# EAGLE design Keychain rev2 (EAGLE 9.5.2)
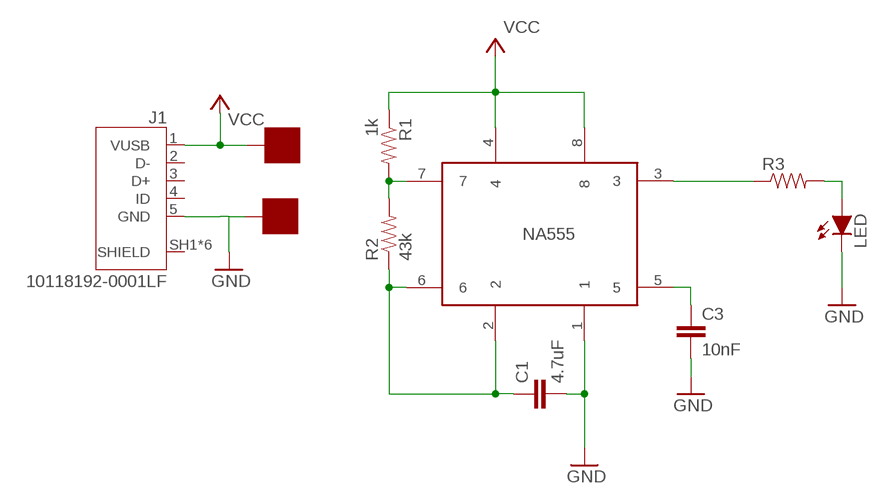
[diagram p0: schematic, sheet 1]

## Parts
5V  SOLDER_PAD  [SOLDER_PAD_XSMALL]
C1  4.7uF  CAP0603-CAP  [0603-CAP]
C3  10nF  CAP0603-CAP  [0603-CAP]
GND  SOLDER_PAD  [SOLDER_PAD_XSMALL]
J1  10118192-0001LF  [AMPHENOL_10118192-0001LF]
LED  LED-0603  [LED-603]
NA555  NA555SO-8  [SOIC-08]
R1  1k  RESISTOR0603-RES  [0603-RES]
R2  43k  RESISTOR0603-RES  [0603-RES]
R3  RESISTOR0603  [0603-RES]

## Nets
GND: C1.2 C3.2 GND.P$1 J1.5(GND) LED.C NA555.1
N$1: LED.A R3.2
N$2: C1.1 NA555.2 NA555.6 R2.1
N$9: NA555.7 R1.2 R2.2
N$13: C3.1 NA555.5
RED: NA555.3 R3.1
VCC: 5V.P$1 J1.1(VUSB) NA555.4 NA555.8 R1.1
Unconnected: J1.2(D-) J1.3(D+) J1.4(ID) J1.SH1(SHIELD) J1.SH2(SHIELD) J1.SH3(SHIELD) J1.SH4(SHIELD) J1.SH5(SHIELD) J1.SH6(SHIELD)

## Library data of the parts
5V GND = HyTechDevices:SOLDER_PAD: Solder pad used to attach wires directly to PCB
C1 C3 = HyTechDevices:CAP: Capacitor Standard 0603 ceramic capacitor, and 0.1" leaded capacitor.; TOLERANCE: 5%; VOLTAGE: 25V
J1 = HyTechDevices:10118192-0001LF: Single Port 5 Contact Horizontal Right Angle Shielded Micro B USB 2.0 Connector; AVAILABILITY: Unavailable; DESCRIPTION: USB - micro B USB 2.0 Receptacle Connector 5 Position Surface Mount, Right Angle; MF: Amphenol ICC; MP: 10118192-0001LF; PACKAGE: None; PRICE: None
LED = HyTechDevices:LED: Light Emitting Diode (LED) Source: Dangerous Prototypes Eagle Library <https://github.com/DangerousPrototypes/Eagle_Part_Library>
NA555 = HyTechDevices:NA555: Texas Instruments NA555 timer. Data sheet <http://www.ti.com/lit/ds/symlink/se555.pdf>
R1 R2 = HyTechDevices:RESISTOR: Resistor Basic schematic elements and footprints for 0603, 1206, and PTH resistors.; TOLERANCE: 1%
R3 = HyTechDevices:RESISTOR: Resistor Basic schematic elements and footprints for 0603, 1206, and PTH resistors.

## Board
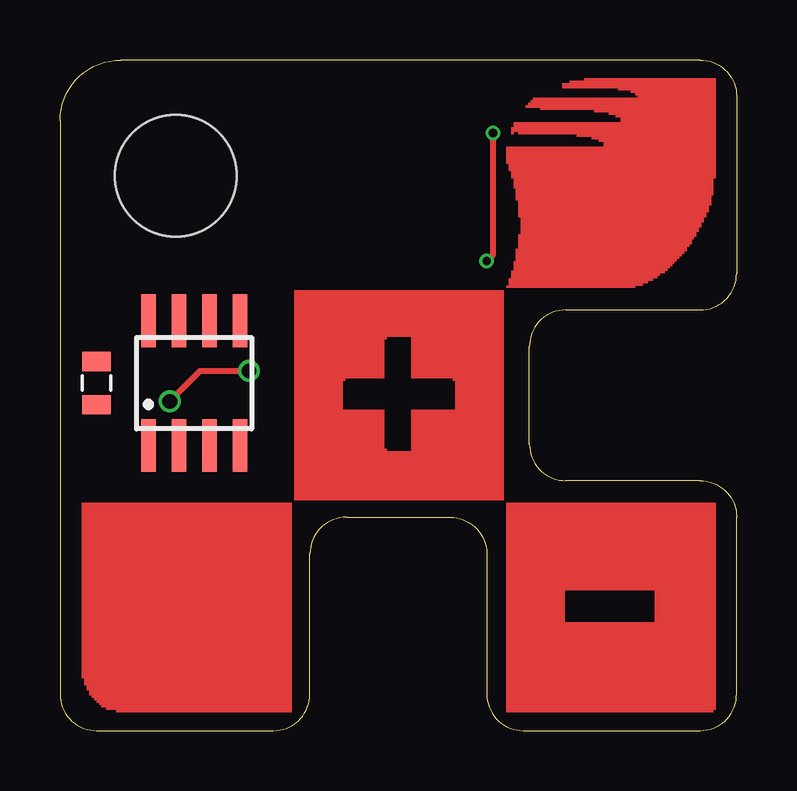
[diagram p1: board, top side]
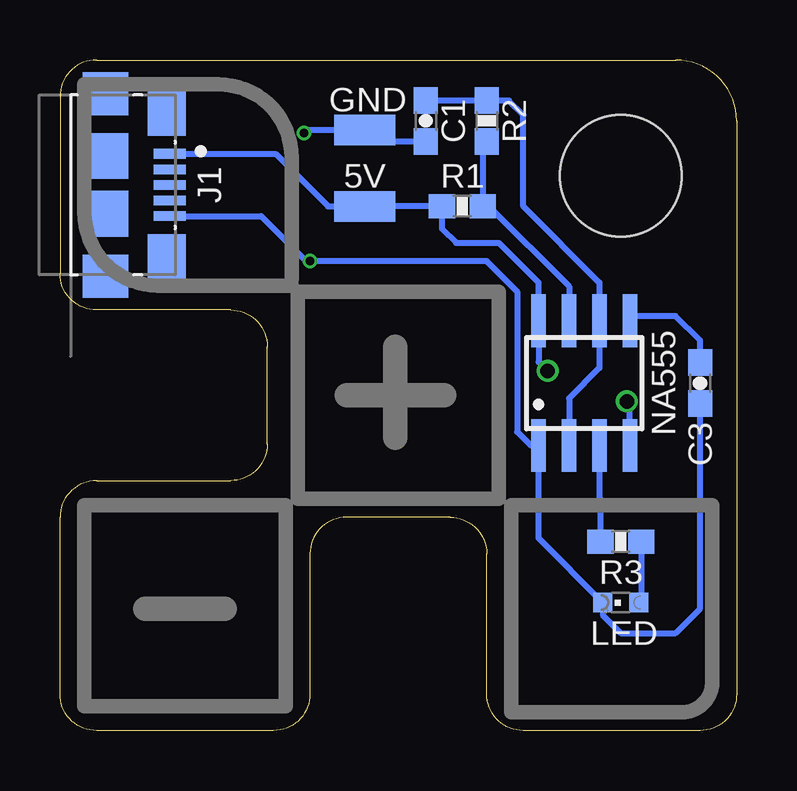
[diagram p2: board, bottom side, seen from below]

Size 28.19 x 27.94 mm. Coordinates in mm from the lower left corner, seen from the top.
Outline: 1.52,0 8.89,0 arc90 10.41,1.52 10.41,7.37 arc-90 11.94,8.89 16.26,8.89 arc-90 17.78,7.37 17.78,1.52 arc90 19.3,0 26.67,0 arc90 28.19,1.52 28.19,8.89 arc90 26.67,10.41 21.08,10.41 arc-90 19.56,11.94 19.56,16 arc-90 21.08,17.53 26.67,17.53 arc90 28.19,19.05 28.19,26.42 arc90 26.67,27.94 2.54,27.94 arc90 0,25.4 0,1.52 arc90 1.52,0
Copper layers (1*16): Top 0.035559375mm / dielectric 1.6mm / Bottom 0.035559375mm
Design rules "DRC Oshpark": minimum track width 6mil, minimum drill 10mil, track to track 6mil, track to pad 6mil, pad to pad 6mil, via to via 6mil, smd to smd 6mil, copper to edge 15mil, drill to drill 6mil, minimum pad ring 5mil, minimum via ring 5mil, stop-mask expansion 2.5mil, vias tented up to drill 30mil, thermal gap 10mil
Holes 5.08 mm at 4.83,23.11

### Footprints (pad centres in the part's own frame; a part is rotated, then mirrored left to right if it is on the bottom)
SOLDER_PAD_XSMALL = smd 2.54 x 1.27: P$1 0,0
0603-CAP = smd 1.1 x 1: 1 -0.85,0; 2 0.85,0
0805@1 = smd 0.8 x 1.2: 1 -0.9,0; 2 0.9,0
SOIC-08 = smd 0.6 x 2.2: 1 -1.905,-2.6; 2 -0.635,-2.6; 3 0.635,-2.6; 4 1.905,-2.6; 5 1.905,2.6; 6 0.635,2.6; 7 -0.635,2.6; 8 -1.905,2.6
AMPHENOL_10118192-0001LF = smd 0.4 x 1.35: 1 -1.3,0; 2 -0.65,0; 3 0,0; 4 0.65,0; 5 1.3,0 | smd 2.1 x 1.6: SH1 -3.1,-0.125; SH2 3.1,-0.125 | smd 1.8 x 1.9: SH3 -3.8,-2.675; SH6 3.8,-2.675 | smd 1.9 x 1.9: SH4 -1.2,-2.675; SH5 1.2,-2.675
LED-603 = smd 0.8 x 0.8: A 0,-0.75; C 0,0.75
0603-RES = smd 1.1 x 1: 1 -0.85,0; 2 0.85,0

### Placement (x,y rotation side)
5V  15.49,21.84 0 bottom
C1  12.95,25.4 270 bottom
C3  1.52,14.48 270 bottom
E$1  [0805@1]  1.52,14.48 90 top
E$2  [SOIC-08]  5.59,14.48 0 top
GND  15.49,25.02 0 bottom
J1  23.62,22.73 270 bottom
LED  4.83,5.33 90 bottom
NA555  6.35,14.48 0 bottom
R1  11.43,21.84 0 bottom
R2  10.41,25.4 270 bottom
R3  4.83,7.87 0 bottom

### Tracks (layer width: path | path; a pad name or v marks a point on that pad's centre or on a via)
GND  (via drill 0.35)
  Top 0.254: v18.03,24.89 18.03,19.81 v17.78,19.56
  Bottom 0.254: C3.2 1.52,5.08 2.54,4.06 4.83,4.06 5.58,4.81 LED.C 8.26,8.01 NA555.1 8.58,11.88 9.14,12.45 9.14,18.29 10.41,19.56 v17.78,19.56 17.94,19.56 19.81,21.43 J1.5 | v18.03,24.89 17.91,25.02 GND.P$1 15.03,24.55 C1.2
N$1
  Bottom 0.254: LED.A 3.98,5.43 R3.2
N$2
  Bottom 0.254: NA555.2 6.98,13.84 5.71,15.11 NA555.6 5.71,18.67 8.89,21.84 8.89,25.65 9.49,26.25 R2.1 C1.1
N$9
  Bottom 0.254: NA555.7 6.98,18.5 10.33,21.84 R1.2 10.58,24.38 R2.2
N$13
  Bottom 0.254: C3.1 1.52,16.26 2.54,17.27 4.25,17.27 NA555.5
RED
  Bottom 0.254: NA555.3 5.71,9.69 5.68,9.65 R3.1
VCC  (via drill 0.61)
  Top 0.254: v4.57,13.72 5.84,14.99 v7.87,14.99
  Bottom 0.254: NA555.4 4.45,13.59 v4.57,13.72 | v7.87,14.99 8.26,15.37 NA555.8 8.26,18.67 9.91,20.32 11.68,20.32 12.28,20.92 R1.1 15.24,21.84 5V.P$1 17.02,21.84 19.21,24.03 J1.1
(copper drawn outside any net)
  shapes: Top area x405

### Text on the board
tDocu: HyTech / Racing